# Altium schematic sheet MCUHighSpeed.SchDoc
size 393 x 279 mm; DrawnBy: Gustav Eckerbom; SheetNumber: 4; SheetTotal: 6; Project: alife7-genx320cam; Project revision: Rev 1; Sheet name: MCUHighSpeed; Sheet size: A3
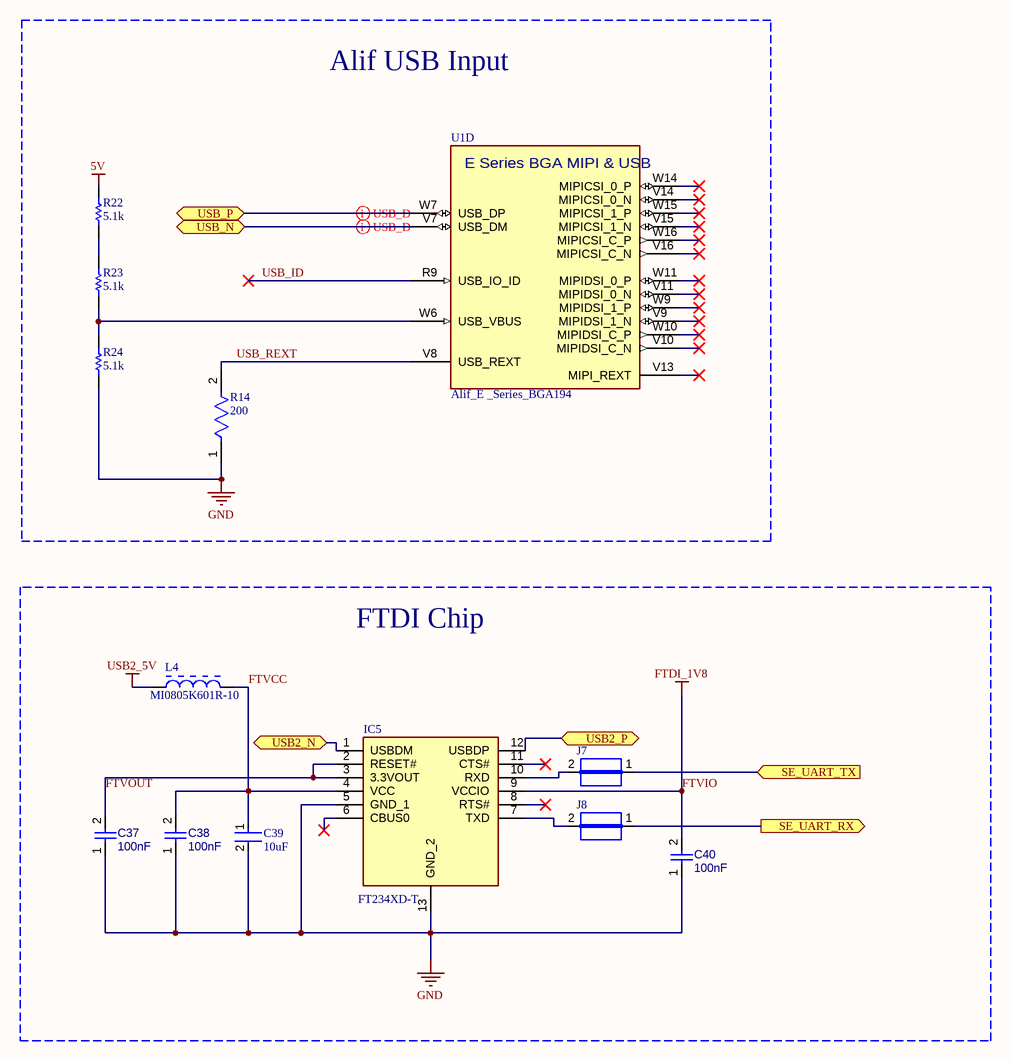
[diagram p0: MCUHighSpeed.SchDoc]

## Parts
C37  100nF  [FP-C0603X104K3RACTU-IPC_C]
C38  100nF  [FP-C0603X104K3RACTU-IPC_C]
C39  10uF  [FP-CC0603-0_15-0_95-IPC_C]
C40  100nF  [FP-C0603X104K3RACTU-IPC_C]
IC5  FT234XD-T  [SON45P300X300X80-13N-D]
J7  JUMPER  [JUMPER]  (value not drawn)
J8  JUMPER  [JUMPER]  (value not drawn)
L4  MI0805K601R-10  [LIRD-MI0805K601R-10-2_V]
R14  value 200  [FP-MCR03-IPC_C]  (hidden comment: 200R)
R22  5.1k  [RESC1608X55X30LL15T15]
R23  5.1k  [RESC1608X55X30LL15T15]
R24  5.1k  [RESC1608X55X30LL15T15]
U1  Alif_E _Series_BGA194  [BGA194 _CENTERED]  (part D of 4)

## Blocks framed on the sheet
Alif USB Input: R14 R22-R24 U1
FTDI Chip: C37-C40 IC5 J7 J8 L4

## Ports
SE_UART_RX (out), SE_UART_TX (in), USB2_N (bidir), USB2_P (bidir), USB_N (bidir), USB_P (bidir)

## Nets
5V: R22.2
FTVIO: C40.2 IC5.9(VCCIO)  [also labelled FTDI_1V8]
GND: C37.1 C38.1 C39.2 C40.1 IC5.5(GND_1) IC5.13(GND_2) R14.1 R24.1
USB2_5V: L4.1
FTVCC: C38.2 C39.1 IC5.4(VCC) L4.2
FTVOUT: C37.2 IC5.2(RESET#) IC5.3(3.3VOUT)
SE_UART_RX: J8.1 ; port SE_UART_RX
SE_UART_TX: J7.1 ; port SE_UART_TX
USB2_N: IC5.1(USBDM) ; port USB2_N
USB2_P: IC5.12(USBDP) ; port USB2_P
USB_ID: U1.R9(USB_IO_ID)
USB_N: U1.V7(USB_DM) ; port USB_N
USB_P: U1.W7(USB_DP) ; port USB_P
USB_REXT: R14.2 U1.V8(USB_REXT)
NetIC5_7: IC5.7(TXD) J8.2
NetIC5_10: IC5.10(RXD) J7.2
NetR22_1: R22.1 R23.2
NetR23_1: R23.1 R24.2 U1.W6(USB_VBUS)

Not connected (* = marked no-connect by the designer): IC5 6(CBUS0)* 8(RTS#)* 11(CTS#)*; U1 V9(MIPIDSI_1_N)* V10(MIPIDSI_C_N)* V11(MIPIDSI_0_N)* V13(MIPI_REXT)* V14(MIPICSI_0_N)* V15(MIPICSI_1_N)* V16(MIPICSI_C_N)* W9(MIPIDSI_1_P)* W10(MIPIDSI_C_P)* W11(MIPIDSI_0_P)* W14(MIPICSI_0_P)* W15(MIPICSI_1_P)* W16(MIPICSI_C_P)*

## Layout directives
differential pair; differential pair class USB_D_: USB_N, USB_P

## Notes on the sheet
- Project:
- Sheet Name
- Project revision:
- Drawn by:
- Sheet size
- SHEET
- OF
- (in symbol E7_B0_194BGA, part D) E Series BGA MIPI & USB

## Library data of the parts
C37 C38 C40 = CMP-001-00090-1: Ceramic Capacitor, Multilayer, Ceramic, 25V, 10% +Tol, 10% -Tol, X7R, 15% TC, 0.1uF, Surface Mount, 0603; RoHS Compliant: Yes; Case/Package: 0603; Max Operating Temperature: 125°C; Min Operating Temperature: -55°C; Capacitor Type: Ceramic; Mounting Technology: Surface Mount; Pins: 2; Value: 100nF
C39 = CMP-001-00088-4: Ceramic Capacitor, Multilayer, Ceramic, 6.3V, 10% +Tol, 10% -Tol, X5R, 15% TC, 10uF, Surface Mount, 0603; Value: 10µF; Min Operating Temperature: -55°C; Max Operating Temperature: 85°C; Case/Package: 0603; RoHS Compliant: Yes; Capacitor Type: Ceramic; Mounting Technology: Surface Mount; Pins: 2
IC5 = FT234XD-T: Integrated Circuit; Manufacturer_Name: FTDI(Future Designs); Datasheet Link: https://datasheet.lcsc.com/szlcsc/1811190128_Future-Designs-FT234XD-T_C89606.pdf; Height: 0.8mm; Manufacturer_Part_Number: FT234XD-T
J7 J8 = CMP-009-00061-2: Pins: 2
L4 = CMP-2000-05196-1: Chip Bead for Power Filtering, 1500 mA, 600 Ohm, -40 to 125 degC, 0805 (2012 Metric), RoHS, Tape and Reel; Manufacturer: Laird; Filter Type: PowerLine; Current Rating (Max): 1.5A; Catalog Drawings: (HI,HZ,LI,MI)0805Series_1.10mmMax.Height; Impedance @ Frequency: 600Ohm@100MHz; Number of Lines: 1; DC Resistance (DCR) (Max): 100mOhm; Other Names: 240-2390-1; Kits: 240-2227-ND-KITEMIFERRITEBEADCHIPSMD; Online Catalog: MISeries; Standard Package: 1; Datasheet Version: Rev. A, 01/2004; Height (Max): 0.043"(1.10mm); Category: Filters; Operating Temperature: -40degC~125degC; Package Description: 2-Pin Surface Mount Device, Body 2 x 1.25 mm; Package / Case: 0805(2012Metric); Package Reference: MI0805K601R-10-2; Packaging: CutTape(CT); Ratings: -; Mounting Type: SurfaceMount; Datasheet URL: https://datasheet.ciiva.com/3082/mi0805k601r-10-a-vp-3082219.pdf; Size / Dimension: 0.079"Lx0.049"W(2.00mmx1.25mm); Family: FerriteBeadsandChips; Manufacturer URL: https://www.lairdtech.com; Series: MI
R14 = CMP-009-00178-1: Fixed Resistor, Metal Glaze/thick Film, 0.1W, 200ohm, 50V, 5% +/-Tol, 200ppm/Cel, Surface Mount, 0603; Power: 100mW; Max Operating Temperature: 155°C; Mounting Technology: Surface Mount; Pins: 2; RoHS Compliant: Yes; Case/Package: 0603; Tolerance: 5%; Min Operating Temperature: -55°C
R22-R24 = CMP-2000-00803-1: Part Number: ERJ-3GEYJ512V; Manufacturer: Panasonic
U1 = E7_B0_194BGA: IC,Alif E7 MCU, Rev B silicon,BGA194; Manufacturer 1: Alif Semi; Manufacturer Part Number 1: AE722F80F55D5LS